# EAGLE schematic breakout (EAGLE 8.3.2)
DESIGNER: JON NEWMAN & JAKOB VOIGTS; DESIGN_NAME: ONIX BREAKOUT BOARD; LICENSE: CC BY-NC-SA 4.0; REVISION: 1.6
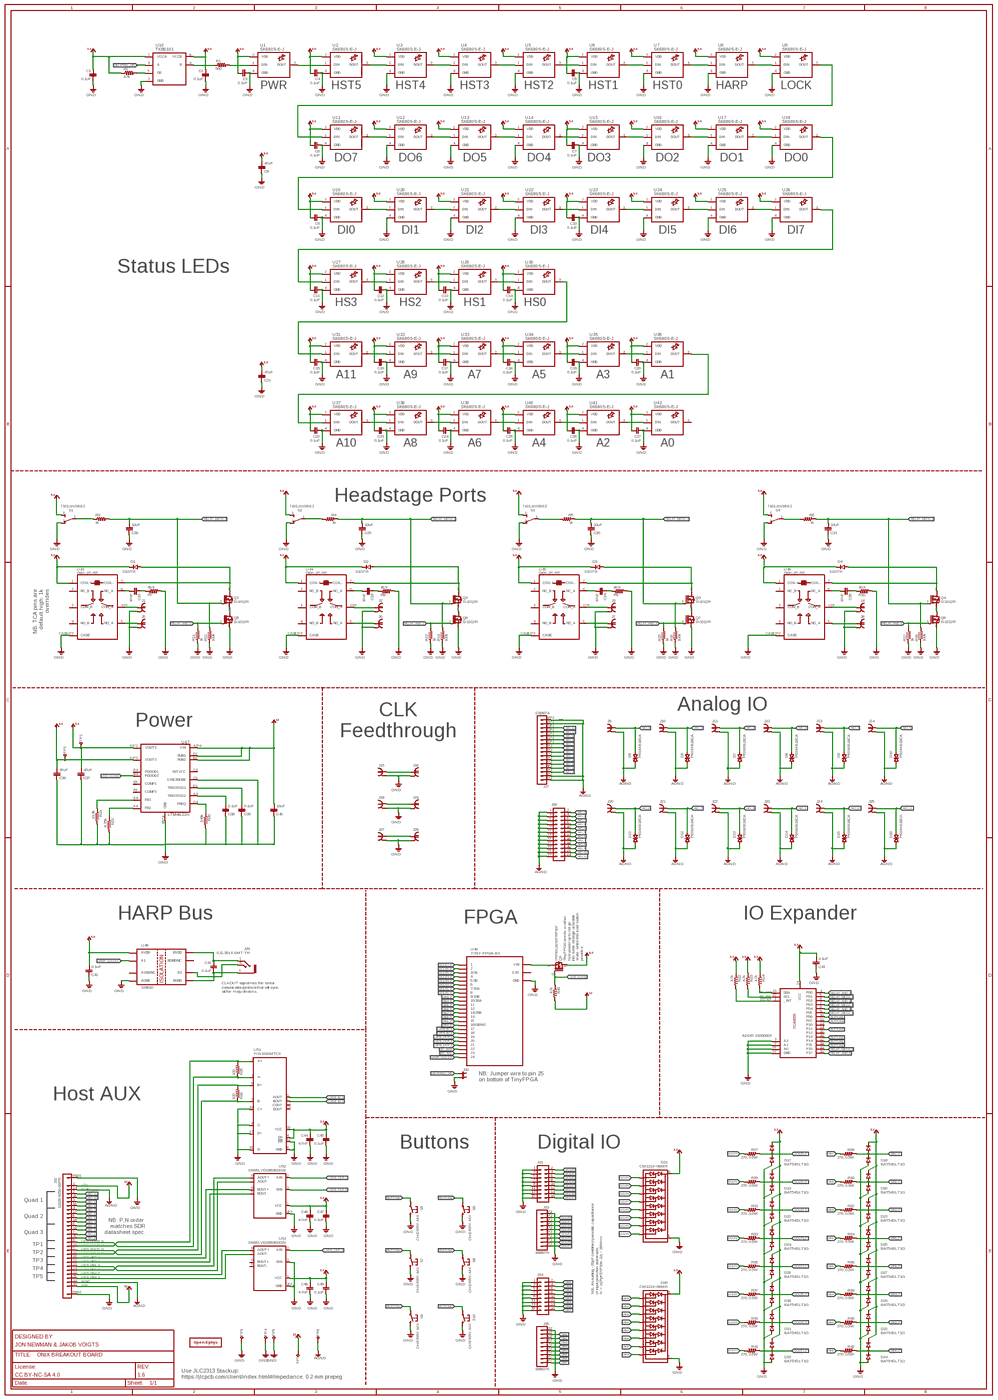
[diagram p0: schematic, sheet 1, overview]
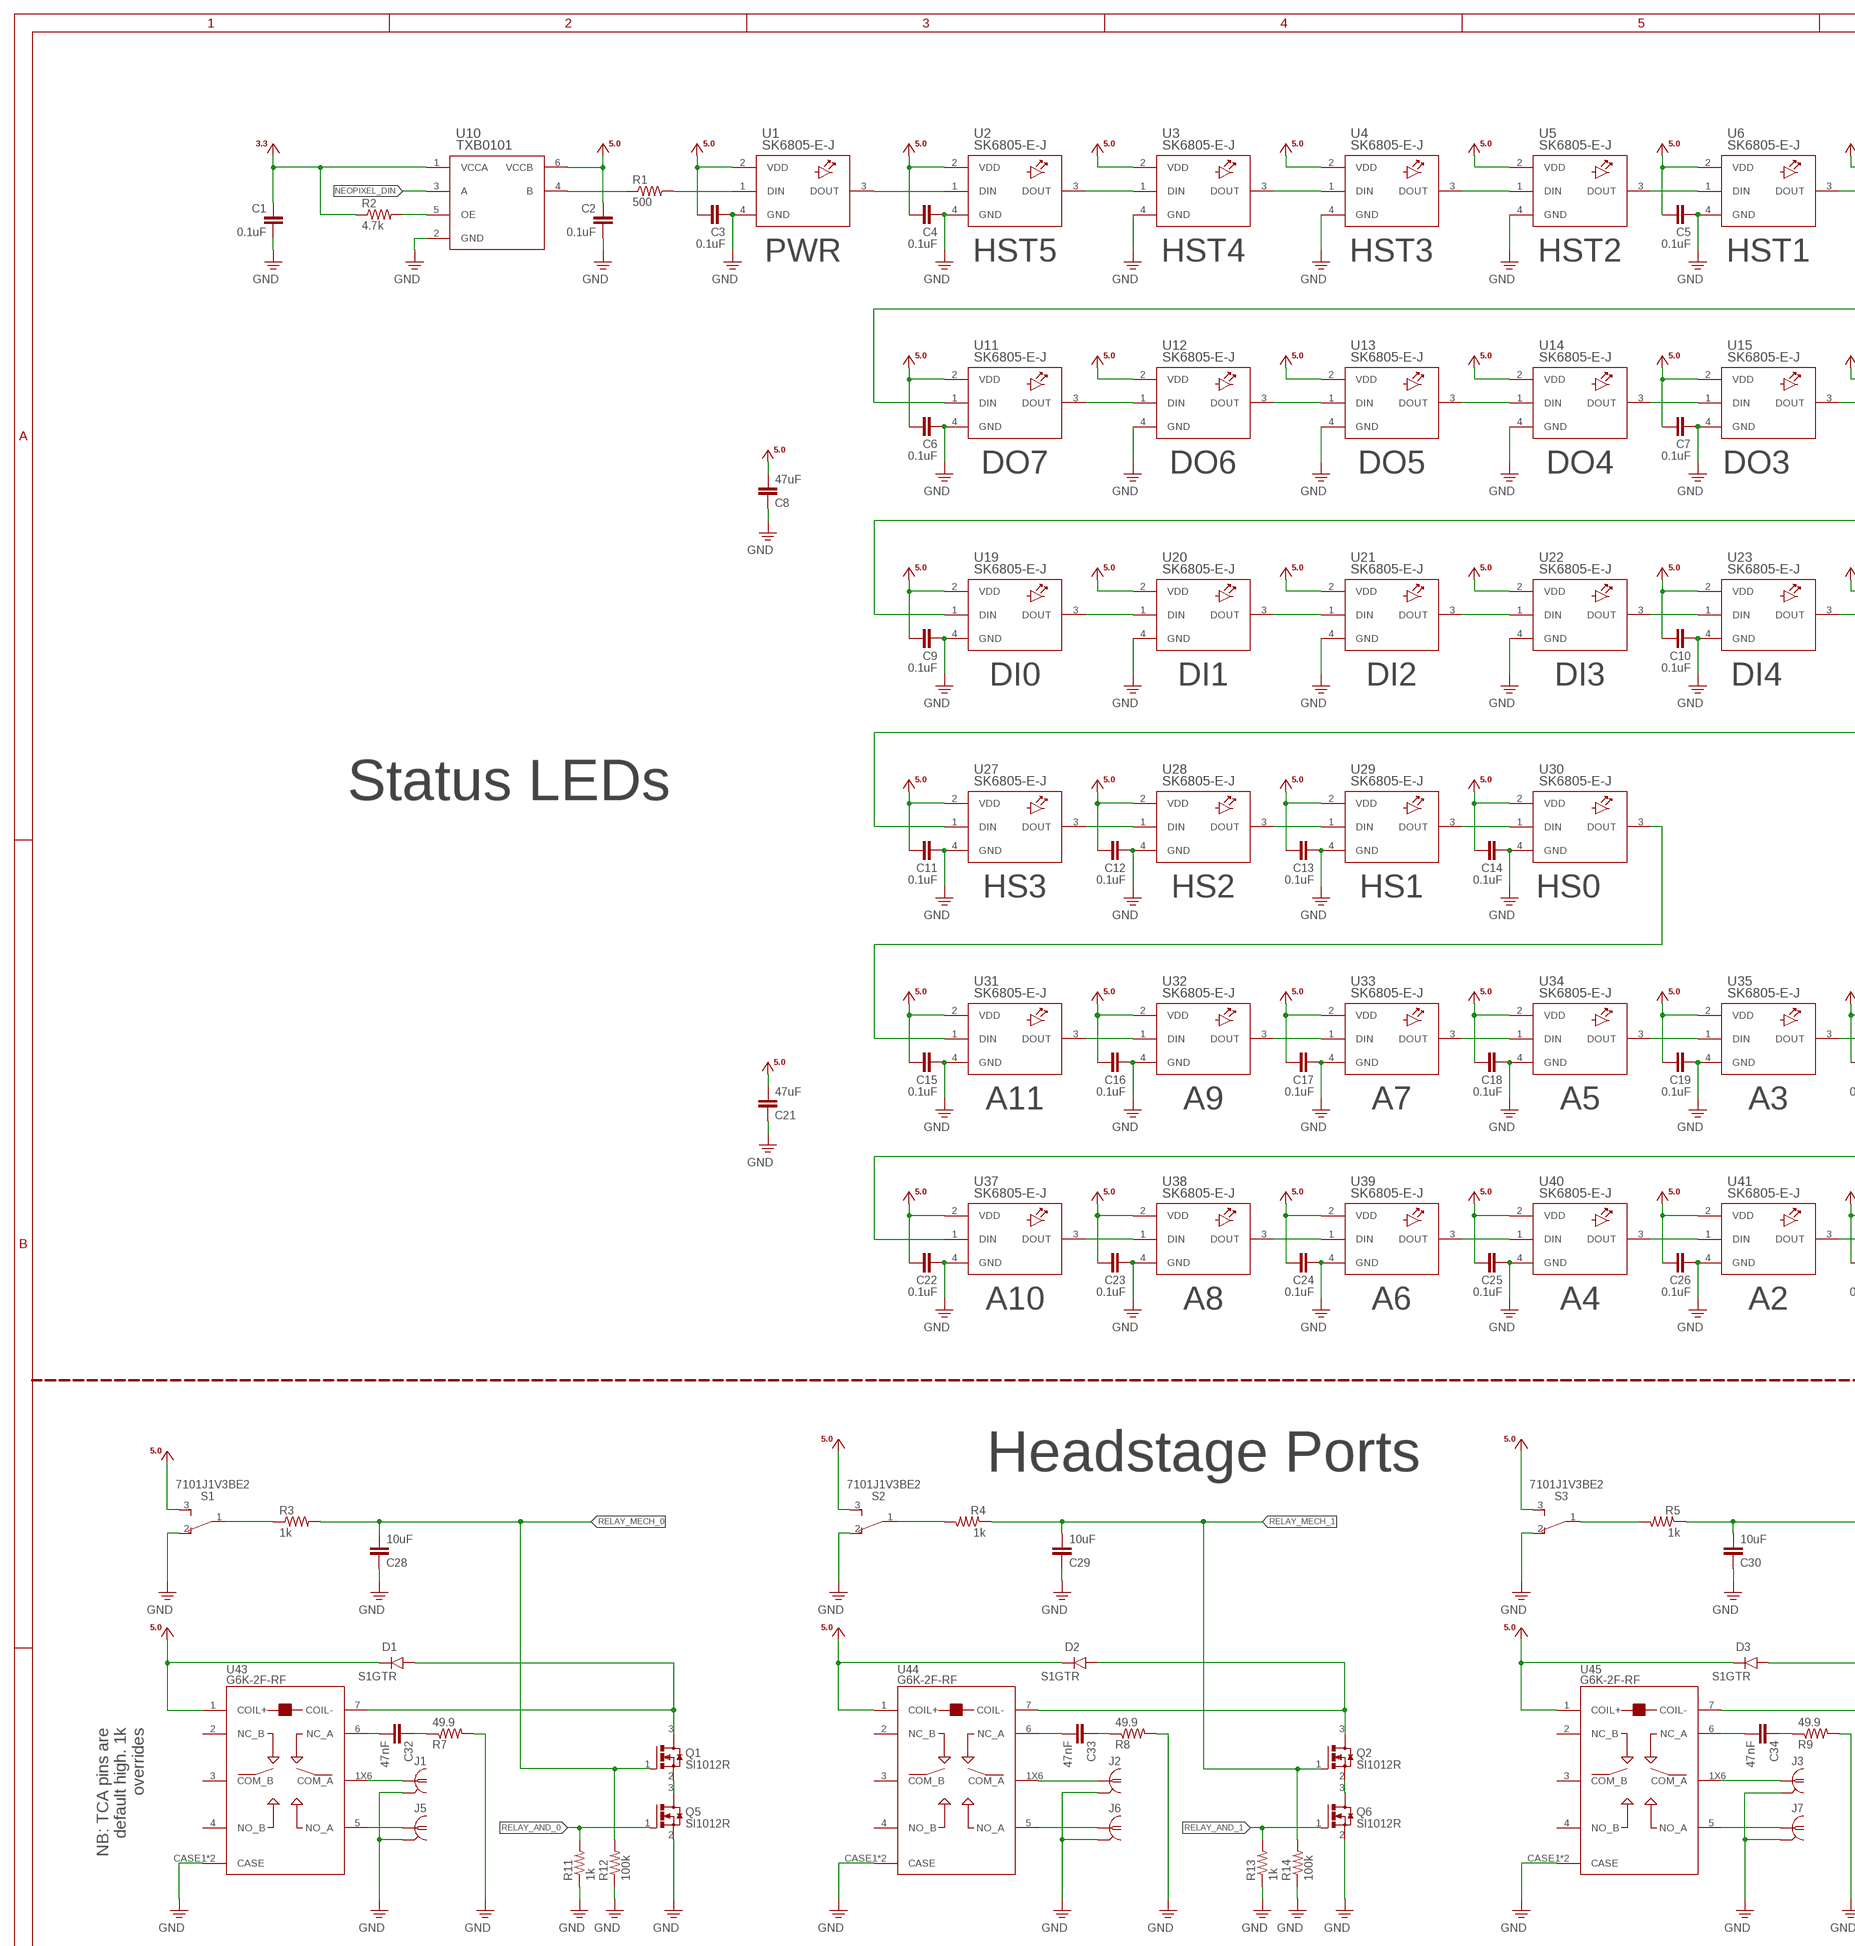
[diagram p1: schematic, sheet 1, part 1 of 4]
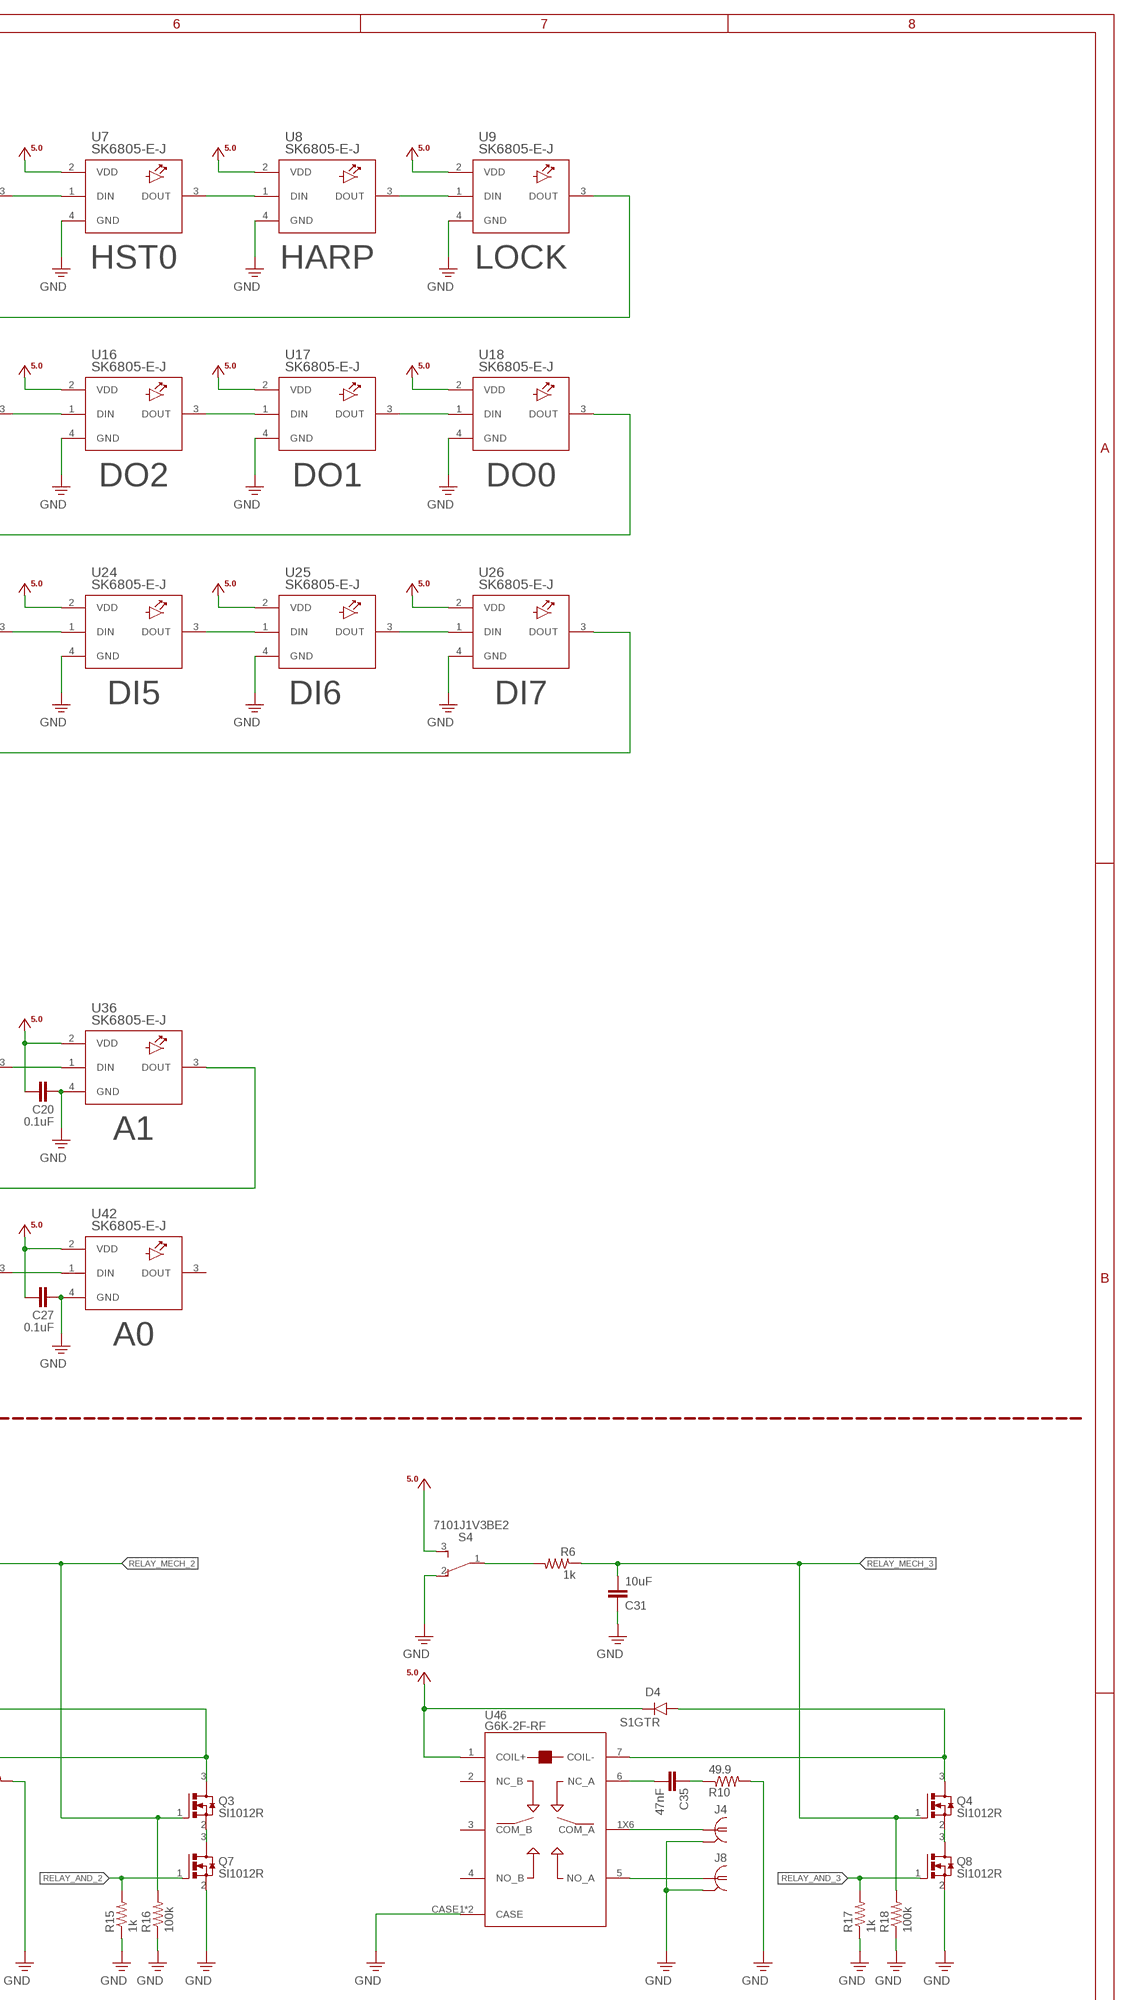
[diagram p2: schematic, sheet 1, part 2 of 4]
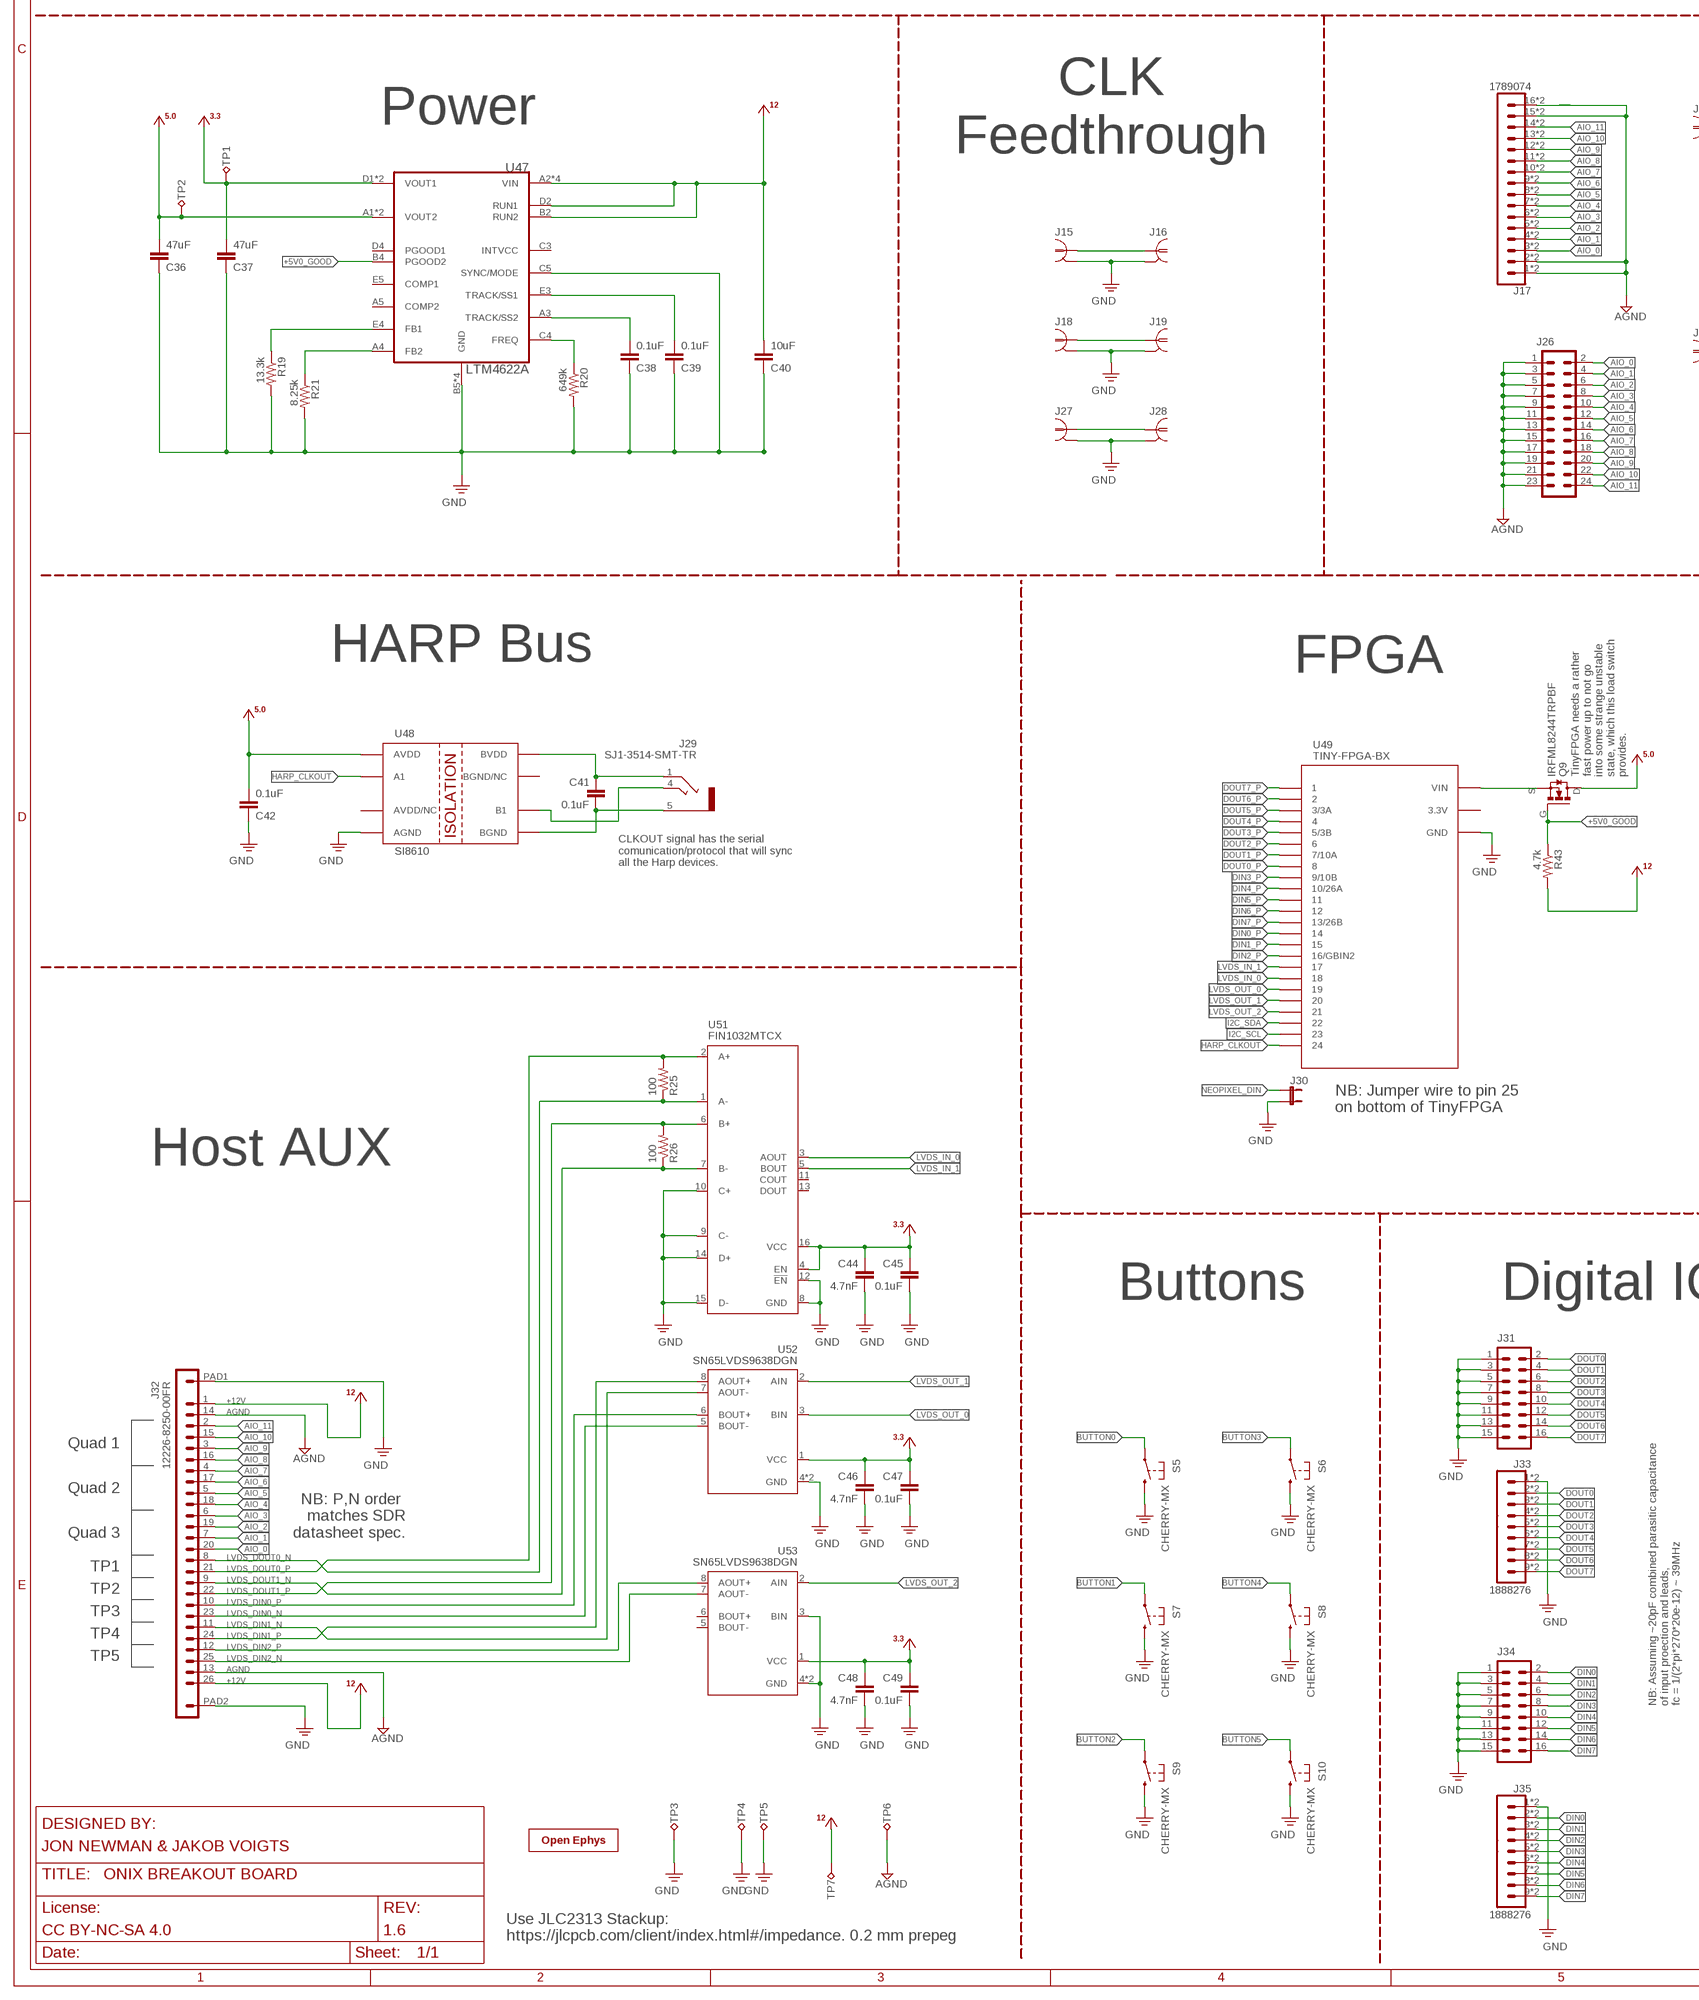
[diagram p3: schematic, sheet 1, part 3 of 4]
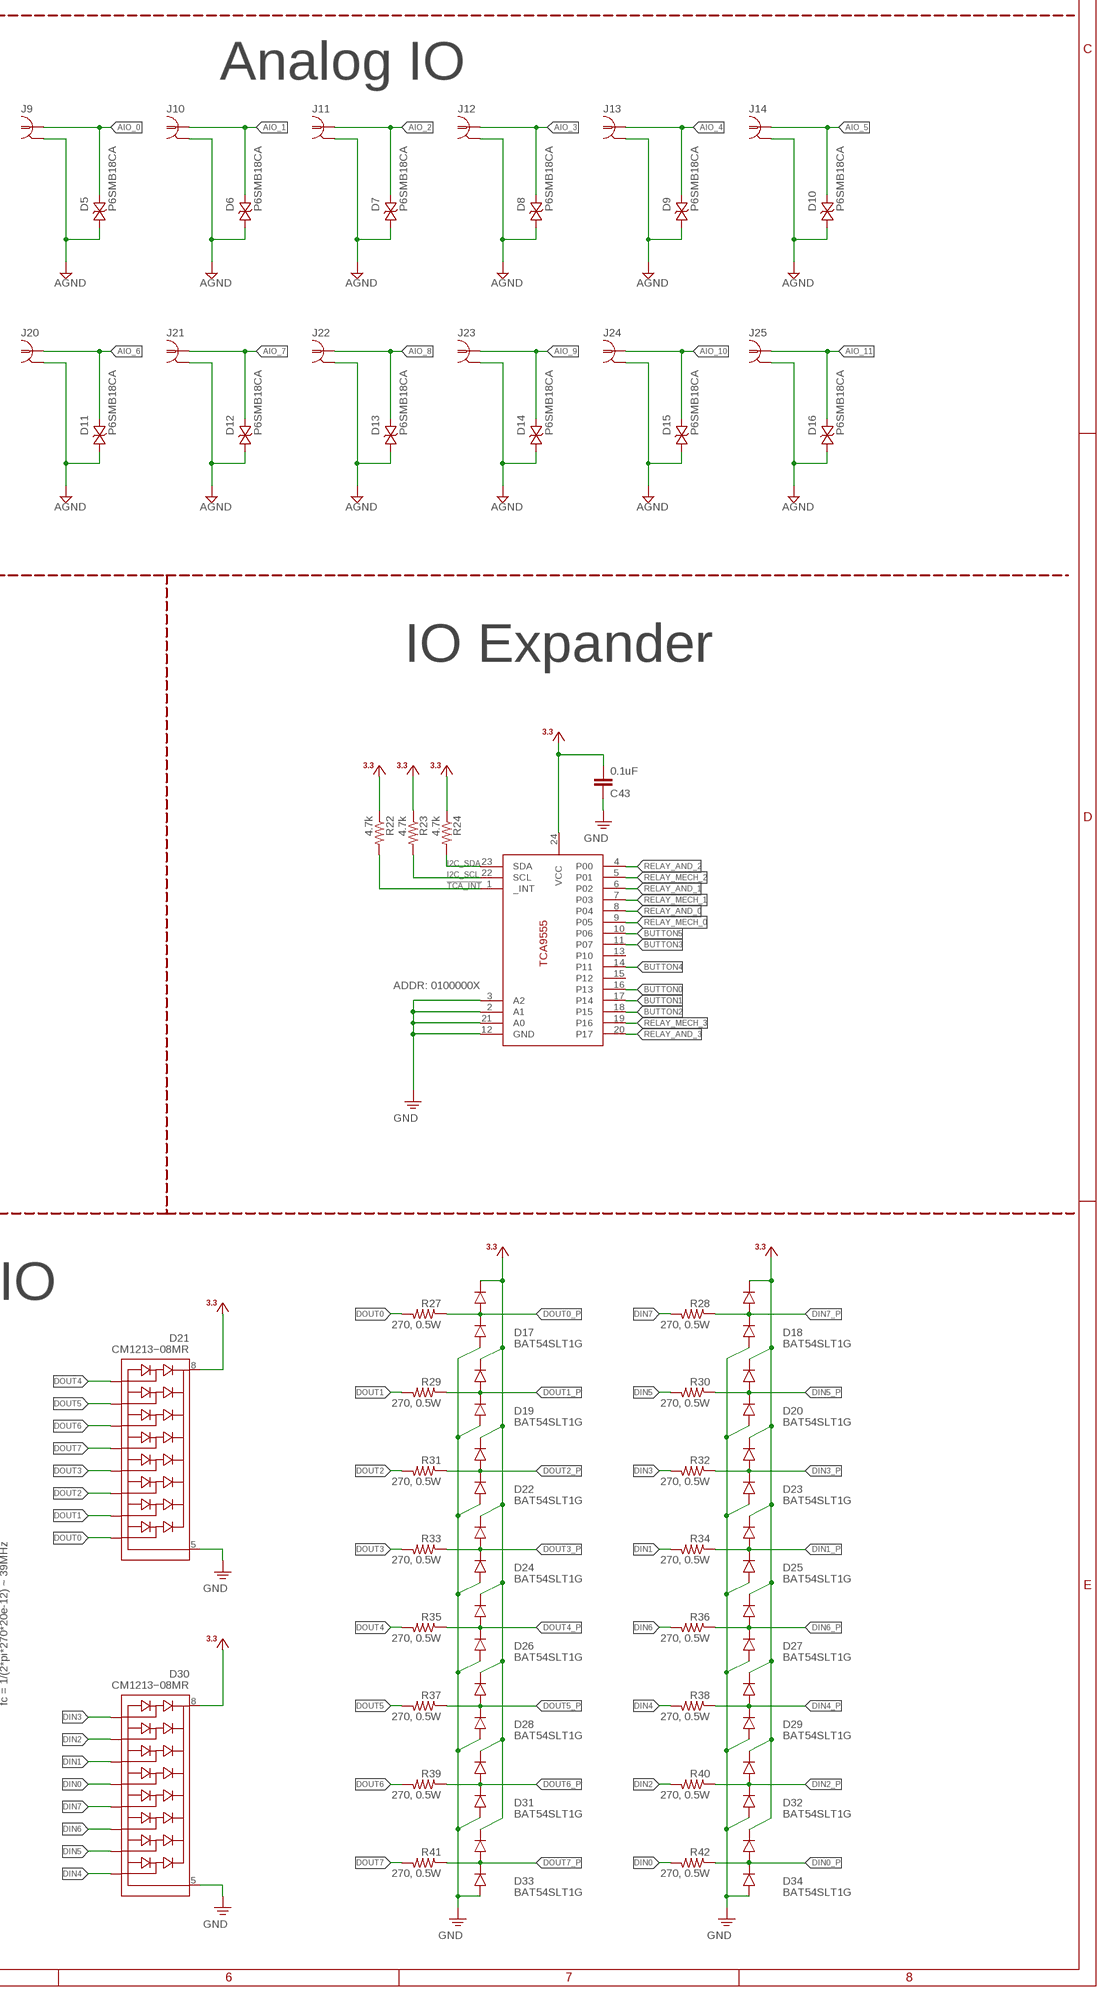
[diagram p4: schematic, sheet 1, part 4 of 4]

## Parts
C1  0.1uF  C_0402  [0402]
C2  0.1uF  C_0402  [0402]
C3  0.1uF  C_0402  [0402]
C4  0.1uF  C_0402  [0402]
C5  0.1uF  C_0402  [0402]
C6  0.1uF  C_0402  [0402]
C7  0.1uF  C_0402  [0402]
C8  47uF  C_1210  [1210]
C9  0.1uF  C_0402  [0402]
C10  0.1uF  C_0402  [0402]
C11  0.1uF  C_0402  [0402]
C12  0.1uF  C_0402  [0402]
C13  0.1uF  C_0402  [0402]
C14  0.1uF  C_0402  [0402]
C15  0.1uF  C_0402  [0402]
C16  0.1uF  C_0402  [0402]
C17  0.1uF  C_0402  [0402]
C18  0.1uF  C_0402  [0402]
C19  0.1uF  C_0402  [0402]
C20  0.1uF  C_0402  [0402]
C21  47uF  C_1210  [1210]
C22  0.1uF  C_0402  [0402]
C23  0.1uF  C_0402  [0402]
C24  0.1uF  C_0402  [0402]
C25  0.1uF  C_0402  [0402]
C26  0.1uF  C_0402  [0402]
C27  0.1uF  C_0402  [0402]
C28  10uF  C_0805  [0805]
C29  10uF  C_0805  [0805]
C30  10uF  C_0805  [0805]
C31  10uF  C_0805  [0805]
C32  47nF  C_0402  [0402]
C33  47nF  C_0402  [0402]
C34  47nF  C_0402  [0402]
C35  47nF  C_0402  [0402]
C36  47uF  C_1210  [1210]
C37  47uF  C_1210  [1210]
C38  0.1uF  C_0402  [0402]
C39  0.1uF  C_0402  [0402]
C40  10uF  C_0805  [0805]
C41  0.1uF  C_0402  [0402]
C42  0.1uF  C_0402  [0402]
C43  0.1uF  C_0402  [0402]
C44  4.7nF  C_0402  [0402]
C45  0.1uF  C_0402  [0402]
C46  4.7nF  C_0402  [0402]
C47  0.1uF  C_0402  [0402]
C48  4.7nF  C_0402  [0402]
C49  0.1uF  C_0402  [0402]
D1  S1GTR  DIODE_S1B-13-F  [SMA-DO214AC]
D2  S1GTR  DIODE_S1B-13-F  [SMA-DO214AC]
D3  S1GTR  DIODE_S1B-13-F  [SMA-DO214AC]
D4  S1GTR  DIODE_S1B-13-F  [SMA-DO214AC]
D5  P6SMB18CA  TVS-DIODE-BI_DO214  [SMA-DO214AC]
D6  P6SMB18CA  TVS-DIODE-BI_DO214  [SMA-DO214AC]
D7  P6SMB18CA  TVS-DIODE-BI_DO214  [SMA-DO214AC]
D8  P6SMB18CA  TVS-DIODE-BI_DO214  [SMA-DO214AC]
D9  P6SMB18CA  TVS-DIODE-BI_DO214  [SMA-DO214AC]
D10  P6SMB18CA  TVS-DIODE-BI_DO214  [SMA-DO214AC]
D11  P6SMB18CA  TVS-DIODE-BI_DO214  [SMA-DO214AC]
D12  P6SMB18CA  TVS-DIODE-BI_DO214  [SMA-DO214AC]
D13  P6SMB18CA  TVS-DIODE-BI_DO214  [SMA-DO214AC]
D14  P6SMB18CA  TVS-DIODE-BI_DO214  [SMA-DO214AC]
D15  P6SMB18CA  TVS-DIODE-BI_DO214  [SMA-DO214AC]
D16  P6SMB18CA  TVS-DIODE-BI_DO214  [SMA-DO214AC]
D17  BAT54SLT1G  DIODE2_SOT23  [SOT23]
D18  BAT54SLT1G  DIODE2_SOT23  [SOT23]
D19  BAT54SLT1G  DIODE2_SOT23  [SOT23]
D20  BAT54SLT1G  DIODE2_SOT23  [SOT23]
D21  CM1213−08MR  TVS-DIODE-BI-8_MSOP  [MSOP-10-3X3]
D22  BAT54SLT1G  DIODE2_SOT23  [SOT23]
D23  BAT54SLT1G  DIODE2_SOT23  [SOT23]
D24  BAT54SLT1G  DIODE2_SOT23  [SOT23]
D25  BAT54SLT1G  DIODE2_SOT23  [SOT23]
D26  BAT54SLT1G  DIODE2_SOT23  [SOT23]
D27  BAT54SLT1G  DIODE2_SOT23  [SOT23]
D28  BAT54SLT1G  DIODE2_SOT23  [SOT23]
D29  BAT54SLT1G  DIODE2_SOT23  [SOT23]
D30  CM1213−08MR  TVS-DIODE-BI-8_MSOP  [MSOP-10-3X3]
D31  BAT54SLT1G  DIODE2_SOT23  [SOT23]
D32  BAT54SLT1G  DIODE2_SOT23  [SOT23]
D33  BAT54SLT1G  DIODE2_SOT23  [SOT23]
D34  BAT54SLT1G  DIODE2_SOT23  [SOT23]
J1  COAX_SMA-VERT  [SMA_JACK_142-0701-201]
J2  COAX_SMA-VERT  [SMA_JACK_142-0701-201]
J3  COAX_SMA-VERT  [SMA_JACK_142-0701-201]
J4  COAX_SMA-VERT  [SMA_JACK_142-0701-201]
J5  COAX_MMCX-THRU  [MMCX-THRU]
J6  COAX_MMCX-THRU  [MMCX-THRU]
J7  COAX_MMCX-THRU  [MMCX-THRU]
J8  COAX_MMCX-THRU  [MMCX-THRU]
J9  COAX_0731010360  [0731010360]
J10  COAX_0731010360  [0731010360]
J11  COAX_0731010360  [0731010360]
J12  COAX_0731010360  [0731010360]
J13  COAX_0731010360  [0731010360]
J14  COAX_0731010360  [0731010360]
J15  COAX_MMCX-THRU  [MMCX-THRU]
J16  COAX_SMA-VERT  [SMA_JACK_142-0701-201]
J17  1789074  PINHD-1X16  [SCREW16-2]
J18  COAX_MMCX-THRU  [MMCX-THRU]
J19  COAX_SMA-VERT  [SMA_JACK_142-0701-201]
J20  COAX_0731010360  [0731010360]
J21  COAX_0731010360  [0731010360]
J22  COAX_0731010360  [0731010360]
J23  COAX_0731010360  [0731010360]
J24  COAX_0731010360  [0731010360]
J25  COAX_0731010360  [0731010360]
J26  69168-124HLF  PINHD-2X12_0.1"  [2X12-BIG]
J27  COAX_MMCX-THRU  [MMCX-THRU]
J28  COAX_SMA-VERT  [SMA_JACK_142-0701-201]
J29  SJ1-3514-SMT-TR  STEREO_JACK  [35RASMT2BHNTRX]
J30  JP2E_THRU-HOLE  [JP2]
J31  69168-116HLF  PINHD-2X8_THRU  [2X08-BIG]
J32  12226-8250-00FR  PINHD-1X26_122  [12226-82X0-00XX]
J33  1888276  PINHD-1X9_SCREW2  [SCREW9-2]
J34  69168-116HLF  PINHD-2X8_THRU  [2X08-BIG]
J35  1888276  PINHD-1X9_SCREW2  [SCREW9-2]
Q1  SI1012R  N-MOSFET_SC75-GSD  [SC75]
Q2  SI1012R  N-MOSFET_SC75-GSD  [SC75]
Q3  SI1012R  N-MOSFET_SC75-GSD  [SC75]
Q4  SI1012R  N-MOSFET_SC75-GSD  [SC75]
Q5  SI1012R  N-MOSFET_SC75-GSD  [SC75]
Q6  SI1012R  N-MOSFET_SC75-GSD  [SC75]
Q7  SI1012R  N-MOSFET_SC75-GSD  [SC75]
Q8  SI1012R  N-MOSFET_SC75-GSD  [SC75]
Q9  IRFML8244TRPBF  N-MOSFET_SOT23-GSD  [SOT23-GSD]
R1  500  R_0402  [0402]
R2  4.7k  R_0402  [0402]
R3  1k  R_0402  [0402]
R4  1k  R_0402  [0402]
R5  1k  R_0402  [0402]
R6  1k  R_0402  [0402]
R7  49.9  R_0402  [0402]
R8  49.9  R_0402  [0402]
R9  49.9  R_0402  [0402]
R10  49.9  R_0402  [0402]
R11  1k  R_0402  [0402]
R12  100k  R_0402  [0402]
R13  1k  R_0402  [0402]
R14  100k  R_0402  [0402]
R15  1k  R_0402  [0402]
R16  100k  R_0402  [0402]
R17  1k  R_0402  [0402]
R18  100k  R_0402  [0402]
R19  13.3k  R_0402  [0402]
R20  649k  R_0402  [0402]
R21  8.25k  R_0402  [0402]
R22  4.7k  R_0402  [0402]
R23  4.7k  R_0402  [0402]
R24  4.7k  R_0402  [0402]
R25  100  R_0402  [0402]
R26  100  R_0402  [0402]
R27  270, 0.5W  R_0805  [0805]
R28  270, 0.5W  R_0805  [0805]
R29  270, 0.5W  R_0805  [0805]
R30  270, 0.5W  R_0805  [0805]
R31  270, 0.5W  R_0805  [0805]
R32  270, 0.5W  R_0805  [0805]
R33  270, 0.5W  R_0805  [0805]
R34  270, 0.5W  R_0805  [0805]
R35  270, 0.5W  R_0805  [0805]
R36  270, 0.5W  R_0805  [0805]
R37  270, 0.5W  R_0805  [0805]
R38  270, 0.5W  R_0805  [0805]
R39  270, 0.5W  R_0805  [0805]
R40  270, 0.5W  R_0805  [0805]
R41  270, 0.5W  R_0805  [0805]
R42  270, 0.5W  R_0805  [0805]
R43  4.7k  R_0402  [0402]
S1  7101J1V3BE2  SPDT_CK-710  [CK_7101J1V3QE2]
S2  7101J1V3BE2  SPDT_CK-710  [CK_7101J1V3QE2]
S3  7101J1V3BE2  SPDT_CK-710  [CK_7101J1V3QE2]
S4  7101J1V3BE2  SPDT_CK-710  [CK_7101J1V3QE2]
S5  CHERRY-MX  SPST_TACT2_CHERRY-MX  [CHERRY-MX]
S6  CHERRY-MX  SPST_TACT2_CHERRY-MX  [CHERRY-MX]
S7  CHERRY-MX  SPST_TACT2_CHERRY-MX  [CHERRY-MX]
S8  CHERRY-MX  SPST_TACT2_CHERRY-MX  [CHERRY-MX]
S9  CHERRY-MX  SPST_TACT2_CHERRY-MX  [CHERRY-MX]
S10  CHERRY-MX  SPST_TACT2_CHERRY-MX  [CHERRY-MX]
TP1  TPTP19R  [TP19R]
TP2  TPTP19R  [TP19R]
TP3  TP_2MM  [TESTPOINT_2MM]
TP4  TP_2MM  [TESTPOINT_2MM]
TP5  TP_2MM  [TESTPOINT_2MM]
TP6  TP_2MM  [TESTPOINT_2MM]
TP7  TP_2MM  [TESTPOINT_2MM]
U1  SK6805-E-J  NEOPIXEL_1.5X1.5  [NEOPIXEL-1.5X1.5]
U2  SK6805-E-J  NEOPIXEL_1.5X1.5  [NEOPIXEL-1.5X1.5]
U3  SK6805-E-J  NEOPIXEL_1.5X1.5  [NEOPIXEL-1.5X1.5]
U4  SK6805-E-J  NEOPIXEL_1.5X1.5  [NEOPIXEL-1.5X1.5]
U5  SK6805-E-J  NEOPIXEL_1.5X1.5  [NEOPIXEL-1.5X1.5]
U6  SK6805-E-J  NEOPIXEL_1.5X1.5  [NEOPIXEL-1.5X1.5]
U7  SK6805-E-J  NEOPIXEL_1.5X1.5  [NEOPIXEL-1.5X1.5]
U8  SK6805-E-J  NEOPIXEL_1.5X1.5  [NEOPIXEL-1.5X1.5]
U9  SK6805-E-J  NEOPIXEL_1.5X1.5  [NEOPIXEL-1.5X1.5]
U10  TXB0101  LEVEL_SHIFTER_SOT23  [SOT23-6]
U11  SK6805-E-J  NEOPIXEL_1.5X1.5  [NEOPIXEL-1.5X1.5]
U12  SK6805-E-J  NEOPIXEL_1.5X1.5  [NEOPIXEL-1.5X1.5]
U13  SK6805-E-J  NEOPIXEL_1.5X1.5  [NEOPIXEL-1.5X1.5]
U14  SK6805-E-J  NEOPIXEL_1.5X1.5  [NEOPIXEL-1.5X1.5]
U15  SK6805-E-J  NEOPIXEL_1.5X1.5  [NEOPIXEL-1.5X1.5]
U16  SK6805-E-J  NEOPIXEL_1.5X1.5  [NEOPIXEL-1.5X1.5]
U17  SK6805-E-J  NEOPIXEL_1.5X1.5  [NEOPIXEL-1.5X1.5]
U18  SK6805-E-J  NEOPIXEL_1.5X1.5  [NEOPIXEL-1.5X1.5]
U19  SK6805-E-J  NEOPIXEL_1.5X1.5  [NEOPIXEL-1.5X1.5]
U20  SK6805-E-J  NEOPIXEL_1.5X1.5  [NEOPIXEL-1.5X1.5]
U21  SK6805-E-J  NEOPIXEL_1.5X1.5  [NEOPIXEL-1.5X1.5]
U22  SK6805-E-J  NEOPIXEL_1.5X1.5  [NEOPIXEL-1.5X1.5]
U23  SK6805-E-J  NEOPIXEL_1.5X1.5  [NEOPIXEL-1.5X1.5]
U24  SK6805-E-J  NEOPIXEL_1.5X1.5  [NEOPIXEL-1.5X1.5]
U25  SK6805-E-J  NEOPIXEL_1.5X1.5  [NEOPIXEL-1.5X1.5]
U26  SK6805-E-J  NEOPIXEL_1.5X1.5  [NEOPIXEL-1.5X1.5]
U27  SK6805-E-J  NEOPIXEL_1.5X1.5  [NEOPIXEL-1.5X1.5]
U28  SK6805-E-J  NEOPIXEL_1.5X1.5  [NEOPIXEL-1.5X1.5]
U29  SK6805-E-J  NEOPIXEL_1.5X1.5  [NEOPIXEL-1.5X1.5]
U30  SK6805-E-J  NEOPIXEL_1.5X1.5  [NEOPIXEL-1.5X1.5]
U31  SK6805-E-J  NEOPIXEL_1.5X1.5  [NEOPIXEL-1.5X1.5]
U32  SK6805-E-J  NEOPIXEL_1.5X1.5  [NEOPIXEL-1.5X1.5]
U33  SK6805-E-J  NEOPIXEL_1.5X1.5  [NEOPIXEL-1.5X1.5]
U34  SK6805-E-J  NEOPIXEL_1.5X1.5  [NEOPIXEL-1.5X1.5]
U35  SK6805-E-J  NEOPIXEL_1.5X1.5  [NEOPIXEL-1.5X1.5]
U36  SK6805-E-J  NEOPIXEL_1.5X1.5  [NEOPIXEL-1.5X1.5]
U37  SK6805-E-J  NEOPIXEL_1.5X1.5  [NEOPIXEL-1.5X1.5]
U38  SK6805-E-J  NEOPIXEL_1.5X1.5  [NEOPIXEL-1.5X1.5]
U39  SK6805-E-J  NEOPIXEL_1.5X1.5  [NEOPIXEL-1.5X1.5]
U40  SK6805-E-J  NEOPIXEL_1.5X1.5  [NEOPIXEL-1.5X1.5]
U41  SK6805-E-J  NEOPIXEL_1.5X1.5  [NEOPIXEL-1.5X1.5]
U42  SK6805-E-J  NEOPIXEL_1.5X1.5  [NEOPIXEL-1.5X1.5]
U43  G6K-2F-RF  G6KU-2F-RF-TR09DC5  [G6KU-2F-RF]
U44  G6K-2F-RF  G6KU-2F-RF-TR09DC5  [G6KU-2F-RF]
U45  G6K-2F-RF  G6KU-2F-RF-TR09DC5  [G6KU-2F-RF]
U46  G6K-2F-RF  G6KU-2F-RF-TR09DC5  [G6KU-2F-RF]
U47  LTM4622A  LTM4622_BGA  [BGA_5X5_625X625]
U48  SI8610  [SO-08]
U49  TINY-FPGA-BX  TINY-FPGA-BX_BASIC  [TINY-FPGA-BX_BASIC]
U50  TCA9555  [TSSOP-24]
U51  FIN1032MTCX  LVDS_RECEIVER_QUAD_TSSOP  [TSSOP-16]
U52  SN65LVDS9638DGN  LVDS_DRIVER_DUAL_MSOP  [MSOP-8-PAD-3X3]
U53  SN65LVDS9638DGN  LVDS_DRIVER_DUAL_MSOP  [MSOP-8-PAD-3X3]
X  OE-LOGO_28X20  [OE-LOGO-28X20]

## Nets
!TCA_INT: R22.2 U50.1(_INT)
+3V3: C1.1 C37.2 C43.2 C44.1 C45.1 C46.1 C47.1 C48.1 C49.1 D17.2(C) D18.2(C) D19.2(C) D20.2(C) D21.8(VCC) D22.2(C) D23.2(C) D24.2(C) D25.2(C) D26.2(C) D27.2(C) D28.2(C) D29.2(C) D30.8(VCC) D31.2(C) D32.2(C) D33.2(C) D34.2(C) R2.1 R22.1 R23.1 R24.1 TP1.TP U10.1(VCCA) U47.D1(VOUT1) U47.E1(VOUT1) U50.24(VCC) U51.4(EN) U51.16(VCC) U52.1(VCC) U53.1(VCC)
+5V0: C2.1 C3.2 C4.2 C5.2 C6.2 C7.2 C8.2 C9.2 C10.2 C11.2 C12.2 C13.2 C14.2 C15.2 C16.2 C17.2 C18.2 C19.2 C20.2 C21.2 C22.2 C23.2 C24.2 C25.2 C26.2 C27.2 C36.2 C42.2 D1.C D2.C D3.C D4.C Q9.D S1.3 S2.3 S3.3 S4.3 TP2.TP U1.2(VDD) U2.2(VDD) U3.2(VDD) U4.2(VDD) U5.2(VDD) U6.2(VDD) U7.2(VDD) U8.2(VDD) U9.2(VDD) U10.6(VCCB) U11.2(VDD) U12.2(VDD) U13.2(VDD) U14.2(VDD) U15.2(VDD) U16.2(VDD) U17.2(VDD) U18.2(VDD) U19.2(VDD) U20.2(VDD) U21.2(VDD) U22.2(VDD) U23.2(VDD) U24.2(VDD) U25.2(VDD) U26.2(VDD) U27.2(VDD) U28.2(VDD) U29.2(VDD) U30.2(VDD) U31.2(VDD) U32.2(VDD) U33.2(VDD) U34.2(VDD) U35.2(VDD) U36.2(VDD) U37.2(VDD) U38.2(VDD) U39.2(VDD) U40.2(VDD) U41.2(VDD) U42.2(VDD) U43.1(COIL+) U44.1(COIL+) U45.1(COIL+) U46.1(COIL+) U47.A1(VOUT2) U47.B1(VOUT2) U48.1(AVDD)
+5V0_GOOD: Q9.G R43.1 U47.B4(PGOOD2)
+12V: C40.2 J32.1 J32.26 R43.2 TP7.1(TP) U47.A2(VIN) U47.B2(RUN2) U47.B3(VIN) U47.D2(RUN1) U47.D3(VIN) U47.E2(VIN)
AGND: D5.A D6.A D7.A D8.A D9.A D10.A D11.A D12.A D13.A D14.A D15.A D16.A J9.2 J9.3 J9.4 J9.5 J10.2 J10.3 J10.4 J10.5 J11.2 J11.3 J11.4 J11.5 J12.2 J12.3 J12.4 J12.5 J13.2 J13.3 J13.4 J13.5 J14.2 J14.3 J14.4 J14.5 J17.1 J17.2 J17.15 J17.16 J17.17 J17.18 J17.31 J17.32 J20.2 J20.3 J20.4 J20.5 J21.2 J21.3 J21.4 J21.5 J22.2 J22.3 J22.4 J22.5 J23.2 J23.3 J23.4 J23.5 J24.2 J24.3 J24.4 J24.5 J25.2 J25.3 J25.4 J25.5 J26.1 J26.3 J26.5 J26.7 J26.9 J26.11 J26.13 J26.15 J26.17 J26.19 J26.21 J26.23 J32.13 J32.14 TP6.1(TP)
AIO_0: D5.C J9.1 J17.3 J17.19 J26.2 J32.20
AIO_1: D6.C J10.1 J17.4 J17.20 J26.4 J32.7
AIO_2: D7.C J11.1 J17.5 J17.21 J26.6 J32.19
AIO_3: D8.C J12.1 J17.6 J17.22 J26.8 J32.6
AIO_4: D9.C J13.1 J17.7 J17.23 J26.10 J32.18
AIO_5: D10.C J14.1 J17.8 J17.24 J26.12 J32.5
AIO_6: D11.C J17.9 J17.25 J20.1 J26.14 J32.17
AIO_7: D12.C J17.10 J17.26 J21.1 J26.16 J32.4
AIO_8: D13.C J17.11 J17.27 J22.1 J26.18 J32.16
AIO_9: D14.C J17.12 J17.28 J23.1 J26.20 J32.3
AIO_10: D15.C J17.13 J17.29 J24.1 J26.22 J32.15
AIO_11: D16.C J17.14 J17.30 J25.1 J26.24 J32.2
BUTTON0: S5.SW1(P) U50.16(P13)
BUTTON1: S7.SW1(P) U50.17(P14)
BUTTON2: S9.SW1(P) U50.18(P15)
BUTTON3: S6.SW1(P) U50.11(P07)
BUTTON4: S8.SW1(P) U50.14(P11)
BUTTON5: S10.SW1(P) U50.10(P06)
DIN0: D30.4(CH4) J34.2 J35.2 J35.11 R42.2
DIN0_P: D34.3(COMM) R42.1 U49.14
DIN1: D30.3(CH3) J34.4 J35.3 J35.12 R34.2
DIN1_P: D25.3(COMM) R34.1 U49.15
DIN2: D30.2(CH2) J34.6 J35.4 J35.13 R40.2
DIN2_P: D32.3(COMM) R40.1 U49.16(16/GBIN2)
DIN3: D30.1(CH1) J34.8 J35.5 J35.14 R32.2
DIN3_P: D23.3(COMM) R32.1 U49.9(9/10B)
DIN4: D30.10(CH8) J34.10 J35.6 J35.15 R38.2
DIN4_P: D29.3(COMM) R38.1 U49.10(10/26A)
DIN5: D30.9(CH7) J34.12 J35.7 J35.16 R30.2
DIN5_P: D20.3(COMM) R30.1 U49.11
DIN6: D30.7(CH6) J34.14 J35.8 J35.17 R36.2
DIN6_P: D27.3(COMM) R36.1 U49.12
DIN7: D30.6(CH5) J34.16 J35.9 J35.18 R28.2
DIN7_P: D18.3(COMM) R28.1 U49.13(13/26B)
DOUT0: D21.10(CH8) J31.2 J33.2 J33.11 R27.2
DOUT0_P: D17.3(COMM) R27.1 U49.8
DOUT1: D21.9(CH7) J31.4 J33.3 J33.12 R29.2
DOUT1_P: D19.3(COMM) R29.1 U49.7(7/10A)
DOUT2: D21.7(CH6) J31.6 J33.4 J33.13 R31.2
DOUT2_P: D22.3(COMM) R31.1 U49.6
DOUT3: D21.6(CH5) J31.8 J33.5 J33.14 R33.2
DOUT3_P: D24.3(COMM) R33.1 U49.5(5/3B)
DOUT4: D21.1(CH1) J31.10 J33.6 J33.15 R35.2
DOUT4_P: D26.3(COMM) R35.1 U49.4
DOUT5: D21.2(CH2) J31.12 J33.7 J33.16 R37.2
DOUT5_P: D28.3(COMM) R37.1 U49.3(3/3A)
DOUT6: D21.3(CH3) J31.14 J33.8 J33.17 R39.2
DOUT6_P: D31.3(COMM) R39.1 U49.2
DOUT7: D21.4(CH4) J31.16 J33.9 J33.18 R41.2
DOUT7_P: D33.3(COMM) R41.1 U49.1
GND: C1.2 C2.2 C3.1 C4.1 C5.1 C6.1 C7.1 C8.1 C9.1 C10.1 C11.1 C12.1 C13.1 C14.1 C15.1 C16.1 C17.1 C18.1 C19.1 C20.1 C21.1 C22.1 C23.1 C24.1 C25.1 C26.1 C27.1 C28.1 C29.1 C30.1 C31.1 C36.1 C37.1 C38.1 C39.1 C40.1 C42.1 C43.1 C44.2 C45.2 C46.2 C47.2 C48.2 C49.2 D17.1(A) D18.1(A) D19.1(A) D20.1(A) D21.5(VSS) D22.1(A) D23.1(A) D24.1(A) D25.1(A) D26.1(A) D27.1(A) D28.1(A) D29.1(A) D30.5(VSS) D31.1(A) D32.1(A) D33.1(A) D34.1(A) J1.GND$1 J1.GND$2 J1.GND$3 J1.GND$4 J2.GND$1 J2.GND$2 J2.GND$3 J2.GND$4 J3.GND$1 J3.GND$2 J3.GND$3 J3.GND$4 J4.GND$1 J4.GND$2 J4.GND$3 J4.GND$4 J5.GND@1 J5.GND@2 J5.GND@3 J5.GND@4 J6.GND@1 J6.GND@2 J6.GND@3 J6.GND@4 J7.GND@1 J7.GND@2 J7.GND@3 J7.GND@4 J8.GND@1 J8.GND@2 J8.GND@3 J8.GND@4 J15.GND@1 J15.GND@2 J15.GND@3 J15.GND@4 J16.GND$1 J16.GND$2 J16.GND$3 J16.GND$4 J18.GND@1 J18.GND@2 J18.GND@3 J18.GND@4 J19.GND$1 J19.GND$2 J19.GND$3 J19.GND$4 J27.GND@1 J27.GND@2 J27.GND@3 J27.GND@4 J28.GND$1 J28.GND$2 J28.GND$3 J28.GND$4 J30.2 J31.1 J31.3 J31.5 J31.7 J31.9 J31.11 J31.13 J31.15 J32.PAD1 J32.PAD2 J33.1 J33.10 J34.1 J34.3 J34.5 J34.7 J34.9 J34.11 J34.13 J34.15 J35.1 J35.10 Q5.2(S) Q6.2(S) Q7.2(S) Q8.2(S) R7.2 R8.2 R9.2 R10.2 R11.1 R12.1 R13.1 R14.1 R15.1 R16.1 R17.1 R18.1 R19.2 R20.2 R21.2 S1.2 S2.2 S3.2 S4.2 S5.SW2(S) S6.SW2(S) S7.SW2(S) S8.SW2(S) S9.SW2(S) S10.SW2(S) TP3.1(TP) TP4.1(TP) TP5.1(TP) U1.4(GND) U2.4(GND) U3.4(GND) U4.4(GND) U5.4(GND) U6.4(GND) U7.4(GND) U8.4(GND) U9.4(GND) U10.2(GND) U11.4(GND) U12.4(GND) U13.4(GND) U14.4(GND) U15.4(GND) U16.4(GND) U17.4(GND) U18.4(GND) U19.4(GND) U20.4(GND) U21.4(GND) U22.4(GND) U23.4(GND) U24.4(GND) U25.4(GND) U26.4(GND) U27.4(GND) U28.4(GND) U29.4(GND) U30.4(GND) U31.4(GND) U32.4(GND) U33.4(GND) U34.4(GND) U35.4(GND) U36.4(GND) U37.4(GND) U38.4(GND) U39.4(GND) U40.4(GND) U41.4(GND) U42.4(GND) U43.CASE1(CASE) U43.CASE2(CASE) U44.CASE1(CASE) U44.CASE2(CASE) U45.CASE1(CASE) U45.CASE2(CASE) U46.CASE1(CASE) U46.CASE2(CASE) U47.B5(GND) U47.C1(GND) U47.C2(GND) U47.C5(SYNC/MODE) U47.D5(GND) U48.4(AGND) U49.GND@1(GND) U49.GND@2(GND) U50.2(A1) U50.3(A2) U50.12(GND) U50.21(A0) U51.8(GND) U51.9(C-) U51.10(C+) U51.12(!EN) U51.14(D+) U51.15(D-) U52.4(GND) U52.PAD(GND) U53.3(BIN) U53.4(GND) U53.PAD(GND)
HARP_CLKOUT: U48.2(A1) U49.24
I2C_SCL: R23.2 U49.23 U50.22(SCL)
I2C_SDA: R24.2 U49.22 U50.23(SDA)
LOCKED: U9.3(DOUT) U11.1(DIN)
LVDS_DIN0_N [100 Ohm Diff Mid]: J32.23 U52.5(BOUT-)
LVDS_DIN0_P [100 Ohm Diff Mid]: J32.10 U52.6(BOUT+)
LVDS_DIN1_N [100 Ohm Diff Mid]: J32.11 U52.7(AOUT-)
LVDS_DIN1_P [100 Ohm Diff Mid]: J32.24 U52.8(AOUT+)
LVDS_DIN2_N [100 Ohm Diff Mid]: J32.25 U53.7(AOUT-)
LVDS_DIN2_P [100 Ohm Diff Mid]: J32.12 U53.8(AOUT+)
LVDS_DOUT0_N [100 Ohm Diff Mid]: J32.8 R25.1 U51.1(A-)
LVDS_DOUT0_P [100 Ohm Diff Mid]: J32.21 R25.2 U51.2(A+)
LVDS_DOUT1_N [100 Ohm Diff Mid]: J32.9 R26.1 U51.7(B-)
LVDS_DOUT1_P [100 Ohm Diff Mid]: J32.22 R26.2 U51.6(B+)
LVDS_IN_0: U49.18 U51.3(AOUT)
LVDS_IN_1: U49.17 U51.5(BOUT)
LVDS_OUT_0: U49.19 U52.3(BIN)
LVDS_OUT_1: U49.20 U52.2(AIN)
LVDS_OUT_2: U49.21 U53.2(AIN)
N$1 [stripline]: J15.SIG J16.CLK
N$3 [stripline]: J18.SIG J19.CLK
N$4 [stripline]: J27.SIG J28.CLK
N$5: D1.A Q1.3(D) U43.7(COIL-)
N$6: Q1.2(S) Q5.3(D)
N$7: U11.3(DOUT) U12.1(DIN)
N$8: U12.3(DOUT) U13.1(DIN)
N$9: U13.3(DOUT) U14.1(DIN)
N$10: U36.3(DOUT) U37.1(DIN)
N$11: U31.3(DOUT) U32.1(DIN)
N$12: D2.A Q2.3(D) U44.7(COIL-)
N$13: U15.3(DOUT) U16.1(DIN)
N$14: U16.3(DOUT) U17.1(DIN)
N$15: C32.2 U43.6(NC_A)
N$16: C41.1 J29.1 U48.8(BVDD)
N$17: C41.2 J29.5 U48.5(BGND)
N$18: J29.4 U48.6(B1)
N$19 [stripline]: J6.SIG U44.5(NO_A)
N$20: U17.3(DOUT) U18.1(DIN)
N$21: U1.3(DOUT) U2.1(DIN)
N$22: C33.1 R8.1
N$23: R3.1 S1.1
N$24: R21.1 U47.A4(FB2)
N$25: R19.1 U47.E4(FB1)
N$26: C38.2 U47.A3(TRACK/SS2)
N$27: C39.2 U47.E3(TRACK/SS1)
N$28 [stripline]: J5.SIG U43.5(NO_A)
N$29 [stripline]: J1.CLK U43.1X6(COM_A)
N$30: C32.1 R7.1
N$31: C33.2 U44.6(NC_A)
N$32: Q3.2(S) Q7.3(D)
N$33: C34.1 R9.1
N$34 [stripline]: J2.CLK U44.1X6(COM_A)
N$35: R4.2 S2.1
N$36: C34.2 U45.6(NC_A)
N$37 [stripline]: J7.SIG U45.5(NO_A)
N$38: R5.2 S3.1
N$40: Q2.2(S) Q6.3(D)
N$41: U2.3(DOUT) U3.1(DIN)
N$42: U3.3(DOUT) U4.1(DIN)
N$43 [stripline]: J3.CLK U45.1X6(COM_A)
N$44: R6.2 S4.1
N$45: C35.1 R10.1
N$46: C35.2 U46.6(NC_A)
N$47 [stripline]: J8.SIG U46.5(NO_A)
N$48 [stripline]: J4.CLK U46.1X6(COM_A)
N$49: U4.3(DOUT) U5.1(DIN)
N$50: D3.A Q3.3(D) U45.7(COIL-)
N$51: U6.3(DOUT) U7.1(DIN)
N$52: U7.3(DOUT) U8.1(DIN)
N$53: U8.3(DOUT) U9.1(DIN)
N$54: R1.2 U1.1(DIN)
N$55: R1.1 U10.4(B)
N$56: U5.3(DOUT) U6.1(DIN)
N$57: R2.2 U10.5(OE)
N$58: U14.3(DOUT) U15.1(DIN)
N$59: D4.A Q4.3(D) U46.7(COIL-)
N$60: Q4.2(S) Q8.3(D)
N$61: Q9.S U49.VIN
N$62: U32.3(DOUT) U33.1(DIN)
N$63: U33.3(DOUT) U34.1(DIN)
N$64: U34.3(DOUT) U35.1(DIN)
N$65: U35.3(DOUT) U36.1(DIN)
N$67: U37.3(DOUT) U38.1(DIN)
N$68: U38.3(DOUT) U39.1(DIN)
N$69: U39.3(DOUT) U40.1(DIN)
N$70: U40.3(DOUT) U41.1(DIN)
N$71: U41.3(DOUT) U42.1(DIN)
N$72: U18.3(DOUT) U19.1(DIN)
N$73: U19.3(DOUT) U20.1(DIN)
N$74: U20.3(DOUT) U21.1(DIN)
N$75: U21.3(DOUT) U22.1(DIN)
N$76: U22.3(DOUT) U23.1(DIN)
N$77: U23.3(DOUT) U24.1(DIN)
N$78: U24.3(DOUT) U25.1(DIN)
N$79: U25.3(DOUT) U26.1(DIN)
N$80: U26.3(DOUT) U27.1(DIN)
N$81: U27.3(DOUT) U28.1(DIN)
N$82: U28.3(DOUT) U29.1(DIN)
N$83: U29.3(DOUT) U30.1(DIN)
N$84: U30.3(DOUT) U31.1(DIN)
N$145: R20.1 U47.C4(FREQ)
NEOPIXEL_DIN: J30.1 U10.3(A)
RELAY_AND_0: Q5.1(G) R11.2 U50.8(P04)
RELAY_AND_1: Q6.1(G) R13.2 U50.6(P02)
RELAY_AND_2: Q7.1(G) R15.2 U50.4(P00)
RELAY_AND_3: Q8.1(G) R17.2 U50.20(P17)
RELAY_MECH_0: C28.2 Q1.1(G) R3.2 R12.2 U50.9(P05)
RELAY_MECH_1: C29.2 Q2.1(G) R4.1 R14.2 U50.7(P03)
RELAY_MECH_2: C30.2 Q3.1(G) R5.1 R16.2 U50.5(P01)
RELAY_MECH_3: C31.2 Q4.1(G) R6.1 R18.2 U50.19(P16)
Unconnected: U42.3(DOUT) U43.2(NC_B) U43.3(COM_B) U43.4(NO_B) U44.2(NC_B) U44.3(COM_B) U44.4(NO_B) U45.2(NC_B) U45.3(COM_B) U45.4(NO_B) U46.2(NC_B) U46.3(COM_B) U46.4(NO_B) U47.A5(COMP2) U47.C3(INTVCC) U47.D4(PGOOD1) U47.E5(COMP1) U48.3(AVDD/NC) U48.7(BGND/NC) U49.3.3V U50.13(P10) U50.15(P12) U51.11(COUT) U51.13(DOUT) U53.5(BOUT-) U53.6(BOUT+)

## Notes on the sheet
- PWR | HST5 | HST4 | HST3 | HST2 | HST1 | HST0 | HARP | LOCK
- DO7 | DO6 | DO5 | DO4 | DO3 | DO2 | DO1 | DO0
- DI0 | DI1 | DI2 | DI3 | DI4 | DI5 | DI6 | DI7
- Status LEDs
- HS3 | HS2 | HS1 | HS0
- A11 | A9 | A7 | A5 | A3 | A1
- A10 | A8 | A6 | A4 | A2 | A0
- Headstage Ports
- NB: TCA pins are
  default high. 1k
  overrides
- Analog IO
- Power
- CLK
  Feedthrough
- HARP Bus | FPGA | IO Expander
- TinyFPGA needs a rather
  fast power up to not go
  into some strange unstable
  state, which this load switch
  provides.
- CLKOUT signal has the serial
  comunication/protocol that will sync
  all the Harp devices.
- ADDR: 0100000X
- NB: Jumper wire to pin 25
  on bottom of TinyFPGA
- Host AUX
- Buttons | Digital IO
- Quad 1
- Quad 2
- Quad 3
- NB: P,N order 
  matches SDR
  datasheet spec.
- TP1
- TP2
- TP3
- TP4
- TP5
- NB: Assuming ~20pF combined parasitic capacitance
  of input proection and leads,
  fc = 1/(2*pi*270*20e-12) ~ 39MHz
- Use JLC2313 Stackup: 
  https://jlcpcb.com/client/index.html#/impedance. 0.2 mm prepeg

## Library data of the parts
C1-C27 C32-C39 C41-C49 = jonnew:C: Capacitor
C28-C31 C40 = jonnew:C: Capacitor; MN: TDK Corp.; PARTNO: C2012X5R1Cxxxxxxx; VID: DK
D1-D4 = jonnew:DIODE: DIODE
D5-D16 = jonnew:TVS-DIODE-BI
D17-D20 D22-D29 D31-D34 = jonnew:DIODE2
D21 D30 = jonnew:TVS-DIODE-BI-8
J1-J16 J18-J25 J27 J28 = jonnew:COAX: COAX CONNECTOR - Edge mount BNC - Vertical BNC - Vertical SMA - etc
J17 = jonnew:PINHD-1X16
J26 = jonnew:PINHD-2X12
J29 = jonnew:STEREO_JACK
J30 = jonnew:JP2E
J31 J34 = jonnew:PINHD-2X8
J32 = jonnew:PINHD-1X26
J33 J35 = jonnew:PINHD-1X9
Q1-Q9 = jonnew:N-MOSFET: N-CHANNEL MOS FET SYMBOL
R1-R43 = jonnew:R: Resistor
S1-S4 = jonnew:SPDT: SPDT Switch
S5-S10 = jonnew:SPST_TACT2
TP1-TP7 = jonnew:TP: Test pad
U1-U9 U11-U42 = jonnew:NEOPIXEL
U10 = jonnew:LEVEL_SHIFTER
U43-U46 = jonnew:G6KU-2F-RF-TR09DC5
U47 = jonnew:LTM4622
U48 = CNP-ics 2:SI8610
U49 = jonnew:TINY-FPGA-BX_BASIC
U50 = jonnew:TCA9555
U51 = jonnew:LVDS_RECEIVER_QUAD
U52 U53 = jonnew:LVDS_DRIVER_DUAL
X = jonnew:OE-LOGO

## Net classes
1 stripline: width 0.48 mm, drill 0.5 mm, clearance 0.1 mm
3 100 Ohm Diff Mid: width 0.19 mm, drill 0.3 mm, clearance 0.09 mm